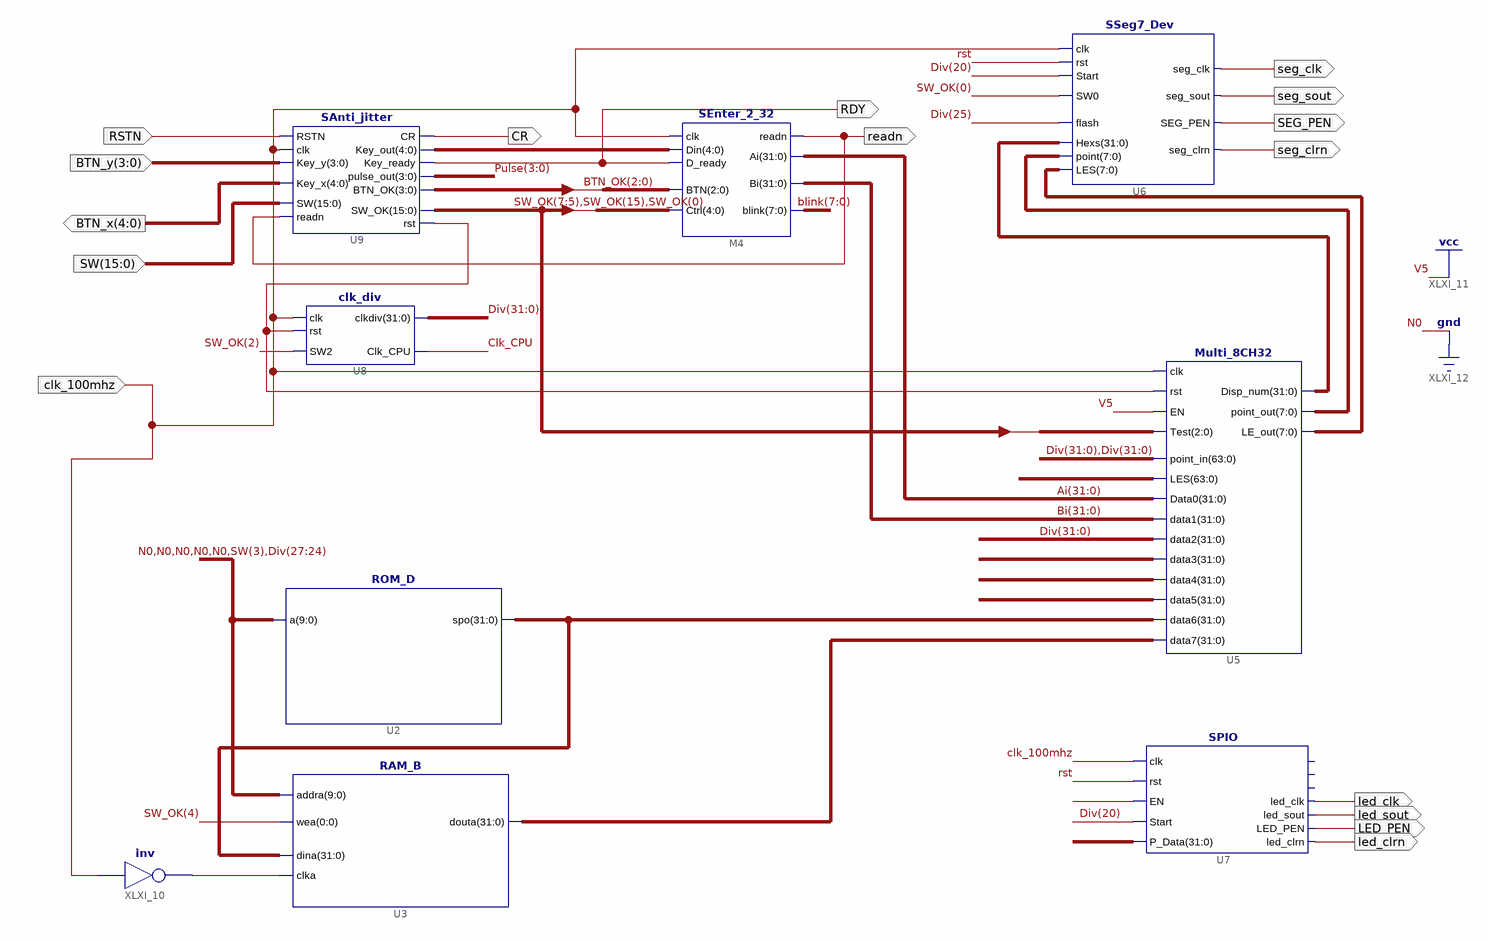
[diagram p0: schematic sheet 1]
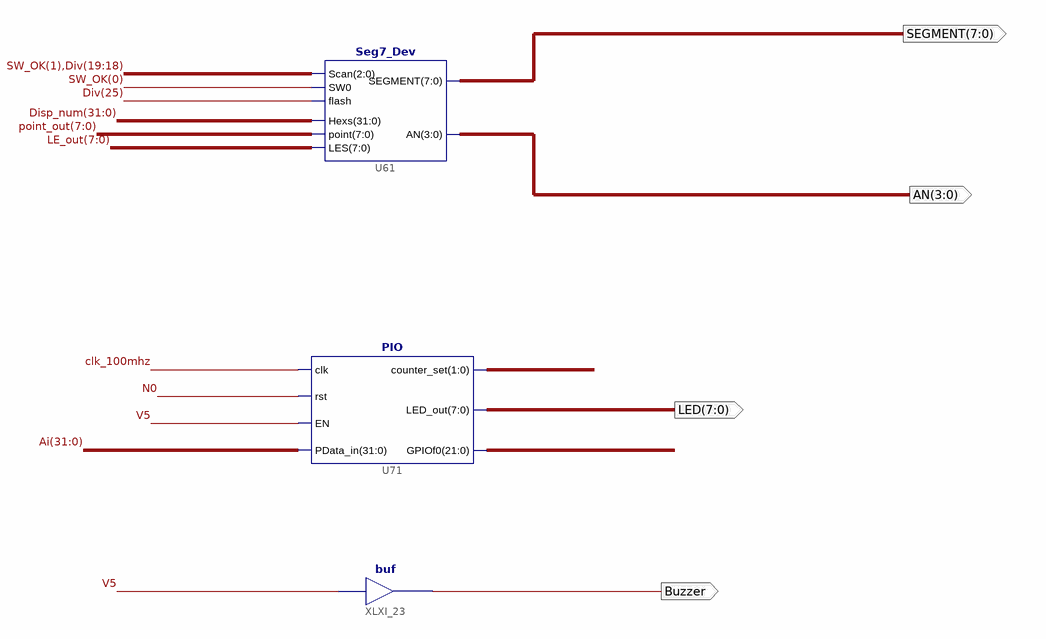
[diagram p1: schematic sheet 2]
// Xilinx ISE schematic Org_Lab1.sch (kintex7) as structural Verilog: 12 symbols, 20 ports
module Org_Lab1 (
  input  RSTN,
  input  [3:0] BTN_y,
  input  [15:0] SW,
  input  clk_100mhz,
  output CR,
  output [4:0] BTN_x,
  output readn,
  output RDY,
  output seg_clk,
  output seg_sout,
  output SEG_PEN,
  output seg_clrn,
  output led_clk,
  output led_sout,
  output LED_PEN,
  output led_clrn,
  output [3:0] AN,
  output [7:0] LED,
  output Buzzer,
  output [7:0] SEGMENT
);

  wire Clk_CPU, rst, XLXN_24, XLXN_34, XLXN_80;
  wire [1:0] XLXN_127;
  wire [3:0] BTN_OK, Pulse;
  wire [4:0] XLXN_4;
  wire [7:0] blink, LE_out, point_out, XLXN_68, XLXN_69;
  wire [15:0] SW_OK;
  wire [21:0] XLXN_125;
  wire [31:0] Ai, Bi, Disp_num, Div, XLXN_37, XLXN_44, XLXN_45, XLXN_46, XLXN_47, XLXN_82;

  SAnti_jitter U9 (
    .SW(SW), .readn(readn), .Key_y(BTN_y), .Key_x(BTN_x), .RSTN(RSTN), .clk(clk_100mhz), .Key_out(XLXN_4),
    .Key_ready(RDY), .CR(CR), .rst(XLXN_24), .SW_OK(SW_OK), .pulse_out(Pulse), .BTN_OK(BTN_OK));
  clk_div U8 (.rst(XLXN_24), .clk(clk_100mhz), .SW2(SW_OK[2]), .clkdiv(Div), .Clk_CPU(Clk_CPU));
  Multi_8CH32 U5 (
    .Test(SW_OK[7:5]), .point_in({Div, Div}), .EN(1'b1), .clk(clk_100mhz), .rst(XLXN_24),
    .LES({{12{1'b0}}, blink[3:0], {32{1'b0}}, blink, blink}), .Data0(Ai), .data1(Bi), .data2(Div),
    .data3(XLXN_47), .data4(XLXN_46), .data5(XLXN_45), .data6(XLXN_37), .data7(XLXN_44), .point_out(XLXN_69),
    .LE_out(XLXN_68), .Disp_num(Disp_num));
  SEnter_2_32 M4 (
    .readn(readn), .Ai(Ai), .Bi(Bi), .blink(blink), .Din(XLXN_4), .D_ready(RDY), .clk(clk_100mhz),
    .Ctrl({SW_OK[7:5], SW_OK[15], SW_OK[0]}), .BTN(BTN_OK[2:0]));
  SSeg7_Dev U6 (
    .LES(XLXN_68), .SEG_PEN(SEG_PEN), .seg_sout(seg_sout), .seg_clrn(seg_clrn), .point(XLXN_69),
    .Hexs(Disp_num), .SW0(SW_OK[0]), .flash(Div[25]), .seg_clk(seg_clk), .clk(clk_100mhz), .rst(rst),
    .Start(Div[20]));
  SPIO U7 (
    .clk(clk_100mhz), .P_Data(XLXN_82), .rst(rst), .EN(XLXN_80), .Start(Div[20]), .led_clk(led_clk),
    .led_clrn(led_clrn), .LED_PEN(LED_PEN), .led_sout(led_sout));  // open: GPIOf0, LED_out, counter_set
  not XLXI_10 (XLXN_34, clk_100mhz);
  ROM_D U2 (.a({{5{1'b0}}, SW[3], Div[27:24]}), .spo(XLXN_37));
  RAM_B U3 (.addra({{5{1'b0}}, SW[3], Div[27:24]}), .clka(XLXN_34), .wea(SW_OK[4]), .dina(XLXN_37), .douta(XLXN_44));
  PIO U71 (
    .clk(clk_100mhz), .rst(1'b0), .EN(1'b1), .PData_in(Ai), .GPIOf0(XLXN_125), .LED_out(LED),
    .counter_set(XLXN_127));
  Seg7_Dev U61 (
    .LES(LE_out), .Scan({SW_OK[1], Div[19:18]}), .SEGMENT(SEGMENT), .AN(AN), .point(point_out),
    .flash(Div[25]), .SW0(SW_OK[0]), .Hexs(Disp_num));
  buf XLXI_23 (Buzzer, 1'b1);
endmodule
